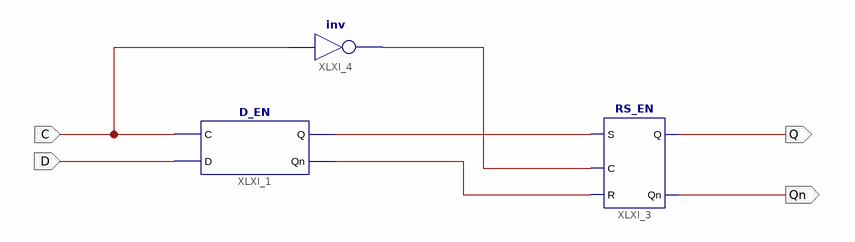
[diagram p0: schematic sheet 1]
// Xilinx ISE schematic D_Trig.sch (kintex7) as structural Verilog: 3 symbols, 4 ports
module D_Trig (
  input  C,
  input  D,
  output Q,
  output Qn
);

  wire XLXN_3, XLXN_4, XLXN_5;

  D_EN XLXI_1 (.C(C), .D(D), .Q(XLXN_4), .Qn(XLXN_5));
  RS_EN XLXI_3 (.C(XLXN_3), .S(XLXN_4), .R(XLXN_5), .Q(Q), .Qn(Qn));
  not XLXI_4 (XLXN_3, C);
endmodule
